# Altium schematic sheet Input_Filter.SchDoc
size Letter; SheetNumber: 3; SheetTotal: 11
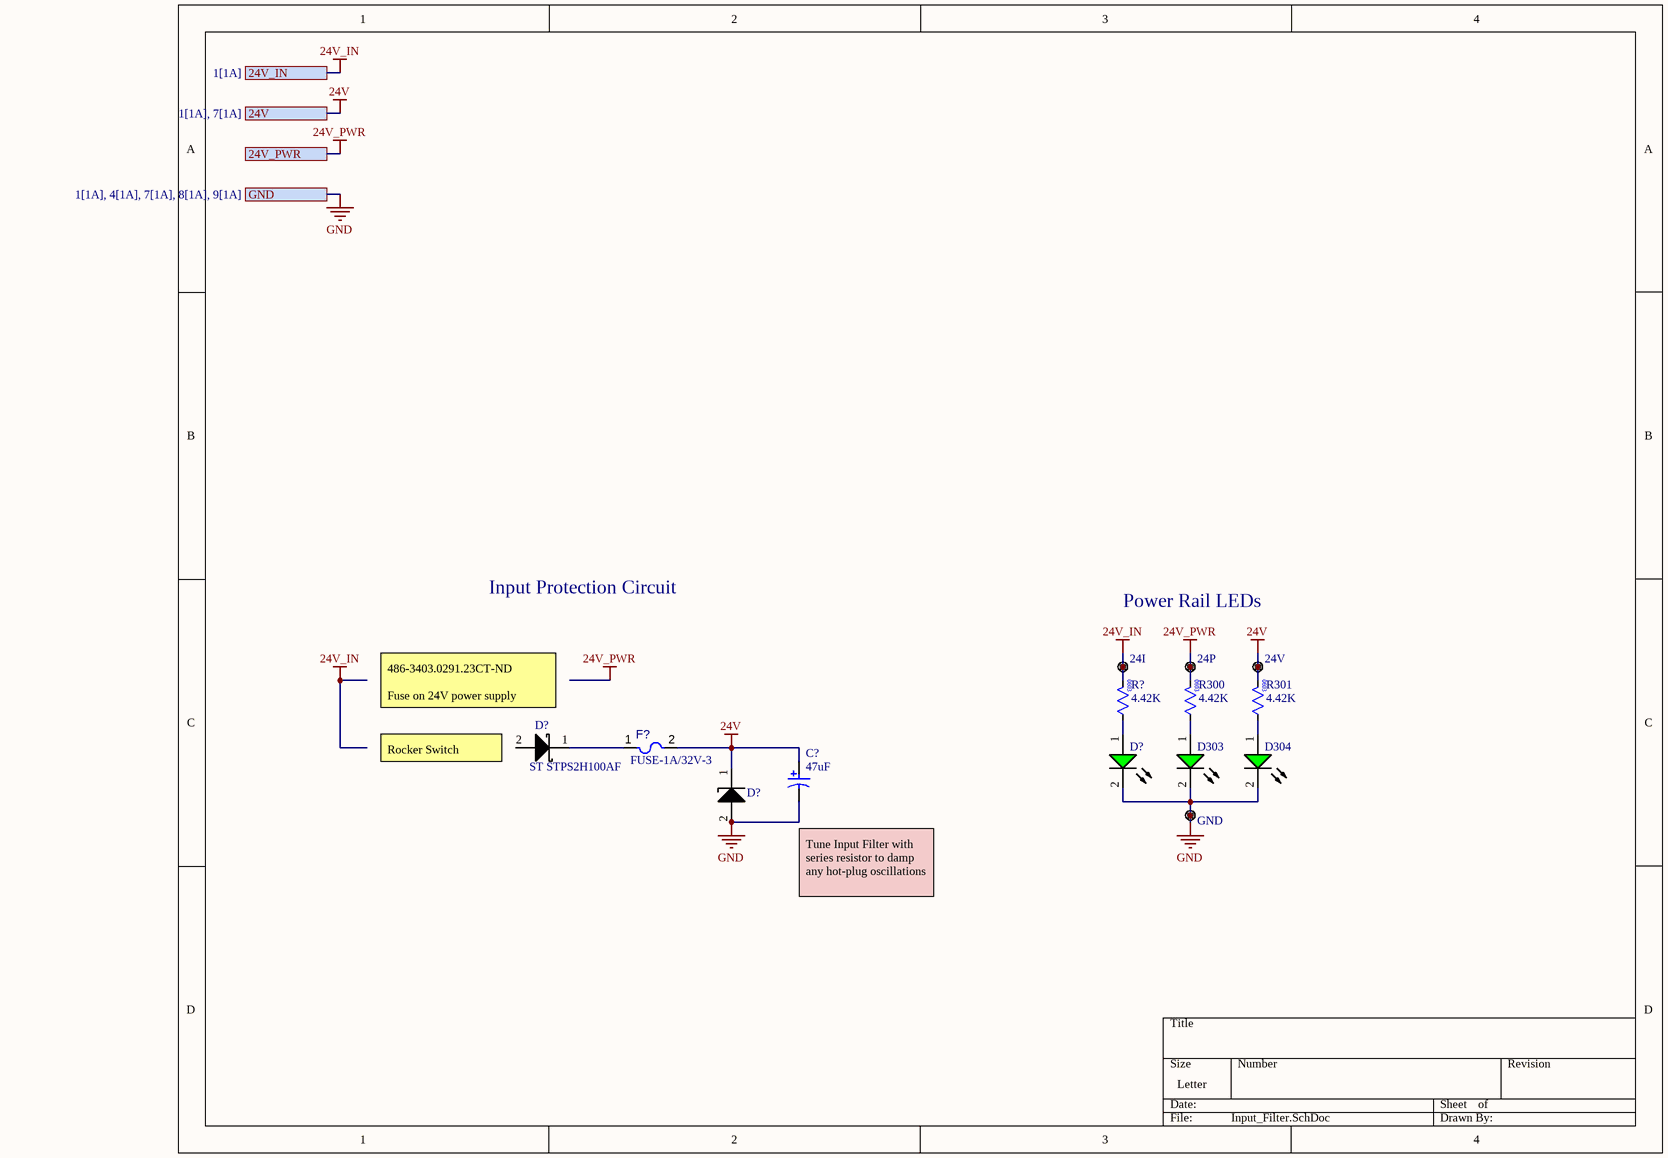
[diagram p0: Input_Filter.SchDoc]

## Parts
(Parts that share a designator on the sheet are numbered #1, #2 ... from top to bottom, then left to right.)
24I  Test Point 2  [Test Point]  (value not drawn)
24P  Test Point 2  [Test Point]  (value not drawn)
24V  Test Point 2  [Test Point]  (value not drawn)
C?  Capacitance: 47uF  [PNSC-FP-V-D_V]  (hidden comment: EEEFP1V470AP)
D303  Lite-On LTST-C193KGKT-5A  [Lite-On LTST-C193KGKT-5A GREEN (1608)]  (value not drawn)
D304  Lite-On LTST-C193KGKT-5A  [Lite-On LTST-C193KGKT-5A GREEN (1608)]  (value not drawn)
D?#1  Lite-On LTST-C193KGKT-5A  [Lite-On LTST-C193KGKT-5A GREEN (1608)]  (value not drawn)
D?#2  ST STPS2H100AF  [ST STPS2H100AF]
D?#3  Vishay SMAJ24A-E3/5A  [VISHAY SMAJ24A-E3/5A (DO214AC/SMA)]  (value not drawn)
F?  FUSE-1A/32V-3  [LFUS-467_V]
GND  Test Point 2  [Test Point]  (value not drawn)
R300  value 4.42K  [0603 RESISTOR (YAGEO)]  (hidden comment: 0603 Generic Resistor)
R301  value 4.42K  [0603 RESISTOR (YAGEO)]  (hidden comment: 0603 Generic Resistor)
R?  value 4.42K  [0603 RESISTOR (YAGEO)]  (hidden comment: 0603 Generic Resistor)

## Ports
24V (see 1[1A], 7[1A]), 24V_IN (see 1[1A]), 24V_PWR, GND (see 1[1A], 4[1A], 7[1A], 8[1A], 9[1A])

## Nets
24V: 24V.1(TP) C?.1 D?#3.1 F?.2 R301.2 ; port 24V
24V_IN: 24I.1(TP) R?.2 ; port 24V_IN
24V_PWR: 24P.1(TP) R300.2 ; port 24V_PWR
GND: C?.2 D303.2(K) D304.2(K) D?#1.2(K) D?#3.2 GND.1(TP) ; port GND
NetD303_1: D303.1(A) R300.1
NetD304_1: D304.1(A) R301.1
NetD?#1_1: D?#1.1(A) R?.1
NetD?#2_1: D?#2.1 F?.1

Not connected (* = marked no-connect by the designer): D?#2 2

## Notes on the sheet
- Input Protection Circuit
- Power Rail LEDs
- (near D?#2) 486-3403.0291.23CT-ND
  Fuse on 24V power supply
- (near D?#2) Rocker Switch
- (near C?) Tune Input Filter with series resistor to damp any hot-plug oscillations
- (in symbol CMP-017-000000-1) 0603

## Library data of the parts
24I 24P 24V GND = CMP-020-000002-1: Test Point Style 2 Thru-Hole; Design Item ID: Test Point 2; Source: UBC Formula Electric.SchLib
C? = CMP-2000-06216-1: Aluminum Electrolytic Capacitor, 47 uF, +/- 20%, 35 V, 2-Pin SMD (Size Code D), -55 to 105 degC, RoHS, Tape and Reel; Manufacturer: Panasonic; Lifetime@Temperature: 2000Hrs@105°C; Type: Can; Rated Voltage: 35V; Ripple Current: 300mA; ESR (Equivalent Series Resistance): 0.26O; Package Reference: FP-V-D; Package Description: 2-Pin Electrolytic Aluminum Capacitor, Body 6.6 x 6.6 mm; Datasheet URL: http://industrial.panasonic.com/cdbs/www-data/pdf/RDE0000/ABA0000C1184.pdf; Series: FP; Operating Temp Range: -55to+105°C; Operating Temp-Max: 105°C; Datasheet Version: 03/2016; Manufacturer URL: http://www.panasonic.com/; Package URL: http://industrial.panasonic.com/cdbs/www-data/pdf/RDE0000/DME0000COL48.pdf; Case Size/Dimension: Ø6.3x5.8mm; Mounting Technology: SurfaceMount; Supplier 1: Digi-Key; Supplier Part Number 1: PCE4552CT-ND
D303 D304 D?#1 = CMP-026-000009-1: LED GREEN CLEAR CHIP SMD; Source: UBC Formula Electric.SchLib; Supplier 1: Digi-Key; Supplier Part Number 1: 160-1828-1-ND; Design Item ID: Lite-On LTST-C193KGKT-5A
D?#2 = CMP-011-0012-1: Diode Schottky 100V 2A Surface Mount SMAflat; Component Type: Standard; Source: Quad_Inverter.SchLib; Design Item ID: ST STPS2H100AF; Pins: 2
D?#3 = CMP-024-000024-1: TVS DIODE 24V 38.9V DO214AC; Source: UBC Formula Electric.SchLib; Supplier Part Number 1: SMAJ24A-E3/5AGICT-ND; Reverse Standoff: 24V; Design Item ID: Vishay SMAJ24A-E3/5A; Supplier 1: Digi-Key
F? = CMP-005-00012-1: Fast Acting Fuse, 1 A, 32 V, -55 to 90 degC, 2-Pin SMD, RoHS, Tape and Reel; Current Rating: 1A; Case/Package: LFUS-467; Pins: 2
R300 R301 R? = CMP-017-000000-1: Source: UBC Formula Electric.SchLib; Design Item ID: 0603 Generic Resistor; Supplier 1: Digi-Key; Supplier Part Number 1: RMCF0603FT4K42CT-ND